# Altium schematic sheet Buck_TPSM82913_1V8.SchDoc
size B; SheetNumber: 10; SheetTotal: 15
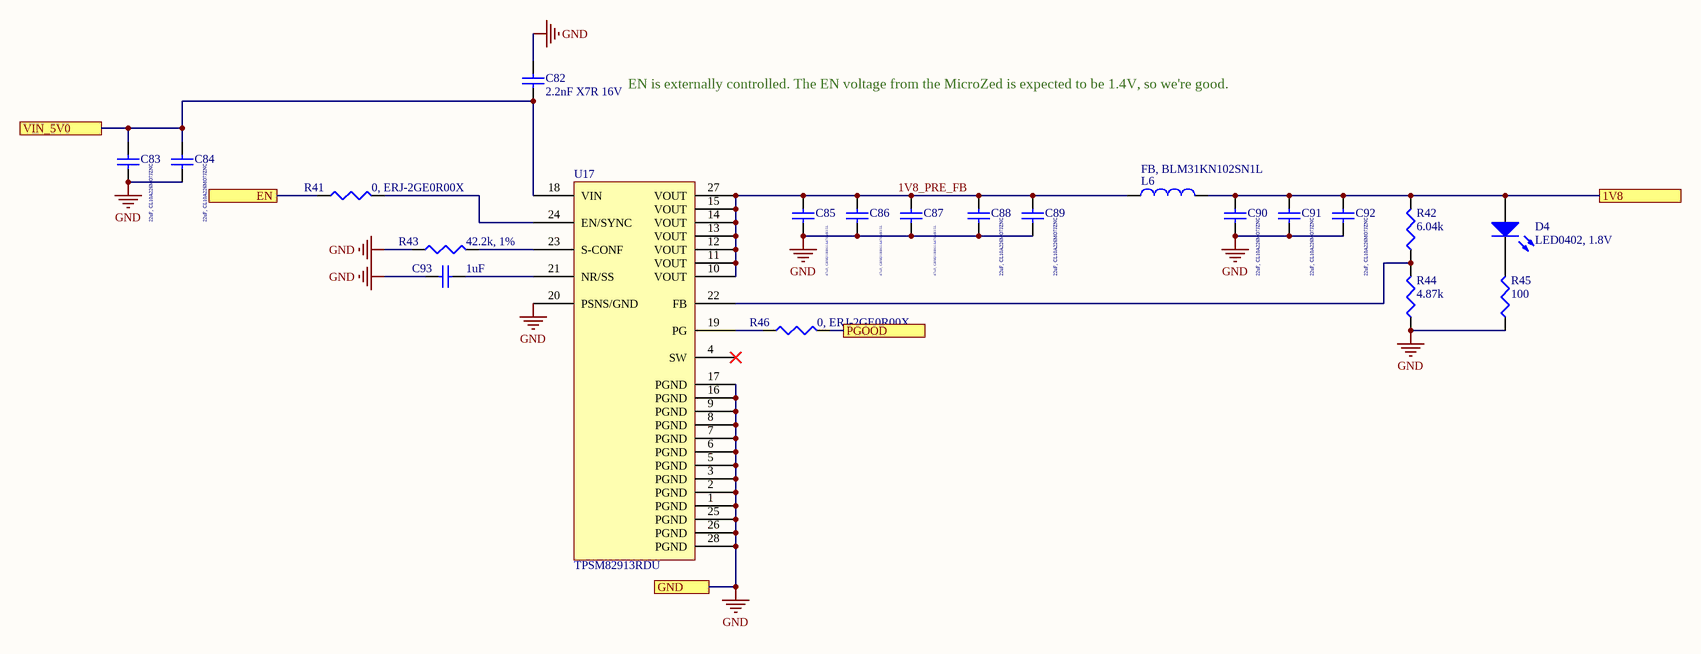
[diagram p0: Buck_TPSM82913_1V8.SchDoc]

## Parts
C82  2.2nF X7R 16V  [SMD-0402]
C83  22uF, CL10A226MO7JZNC  [SMD-0603]
C84  22uF, CL10A226MO7JZNC  [SMD-0603]
C85  47uF, GRM21BR61A476ME15L  [SMD-0805]
C86  47uF, GRM21BR61A476ME15L  [SMD-0805]
C87  47uF, GRM21BR61A476ME15L  [SMD-0805]
C88  22uF, CL10A226MO7JZNC  [SMD-0603]
C89  22uF, CL10A226MO7JZNC  [SMD-0603]
C90  22uF, CL10A226MO7JZNC  [SMD-0603]
C91  22uF, CL10A226MO7JZNC  [SMD-0603]
C92  22uF, CL10A226MO7JZNC  [SMD-0603]
C93  1uF  [SMD-0402]
D4  LED0402, 1.8V  [LED-0402]
L6  FB, BLM31KN102SN1L  [SMD-1206]
R41  0, ERJ-2GE0R00X  [SMD-0402]
R42  6.04k  [SMD-0402]
R43  42.2k, 1%  [SMD-0402]
R44  4.87k  [SMD-0402]
R45  100  [SMD-0402]
R46  0, ERJ-2GE0R00X  [SMD-0402]
U17  TPSM82913RDU  [TPSM82913DRUR]

## Ports
1V8 (see Microzed_Interfaces[3B]), EN (see Microzed_Interfaces[3B]), GND (see Microzed_Interfaces[3B], 3V7_to_3V3_LDO[1B], 5V5_to_5V0_LDO[1C], Buck_TPSM82913_3V7[3C], Buck_TPSM82913_5V0[3C], Buck_TPSM82913_5V5[2C], Clocking_and_LO[2A], Fan_Interfaces[2B], IQ_Demod[1C], IQ_Mod[1B], LMX2820[4D], Microzed_Interfaces[1A], Power_Supply[6B], Voltage_Conv_Bidirectional[1B]), PGOOD (see Microzed_Interfaces[3B]), VIN_5V0 (see Microzed_Interfaces[3B])

## Nets
GND: C82.2 C83.1 C84.1 C85.1 C86.1 C87.1 C88.1 C89.1 C90.1 C91.1 C92.1 C93.1 R43.1 R44.1 R45.1 U17.1(PGND) U17.2(PGND) U17.3(PGND) U17.5(PGND) U17.6(PGND) U17.7(PGND) U17.8(PGND) U17.9(PGND) U17.16(PGND) U17.17(PGND) U17.20(PSNS/GND) U17.25(PGND) U17.26(PGND) U17.28(PGND) ; port GND
1V8: C90.2 C91.2 C92.2 D4.1(A) L6.2 R42.2 ; port 1V8
1V8_PRE_FB: C85.2 C86.2 C87.2 C88.2 C89.2 L6.1 U17.10(VOUT) U17.11(VOUT) U17.12(VOUT) U17.13(VOUT) U17.14(VOUT) U17.15(VOUT) U17.27(VOUT)
EN: R41.1 ; port EN
PGOOD: R46.2 ; port PGOOD
VIN_5V0: C82.1 C83.2 C84.2 U17.18(VIN) ; port VIN_5V0
NetC93_2: C93.2 U17.21(NR/SS)
NetD4_2: D4.2(K) R45.2
NetR41_2: R41.2 U17.24(EN/SYNC)
NetR42_1: R42.1 R44.2 U17.22(FB)
NetR43_2: R43.2 U17.23(S-CONF)
NetR46_1: R46.1 U17.19(PG)

Not connected (* = marked no-connect by the designer): U17 4(SW)*

## Notes on the sheet
- EN is externally controlled. The EN voltage from the MicroZed is expected to be 1.4V, so we're good.

## Library data of the parts
C82 C93 = CAP0402: Ceramic Capacitor 0402
C83 C84 C88-C92 = CAP0603: Ceramic Capacitor 0603
C85-C87 = CAP0805: Ceramic Capacitor 0805 Imperial (2012 Metric)
D4 = LED0402: LED 0402
L6 = L1206: Inductor 1206
R41-R46 = RES0402: Resistor-0402